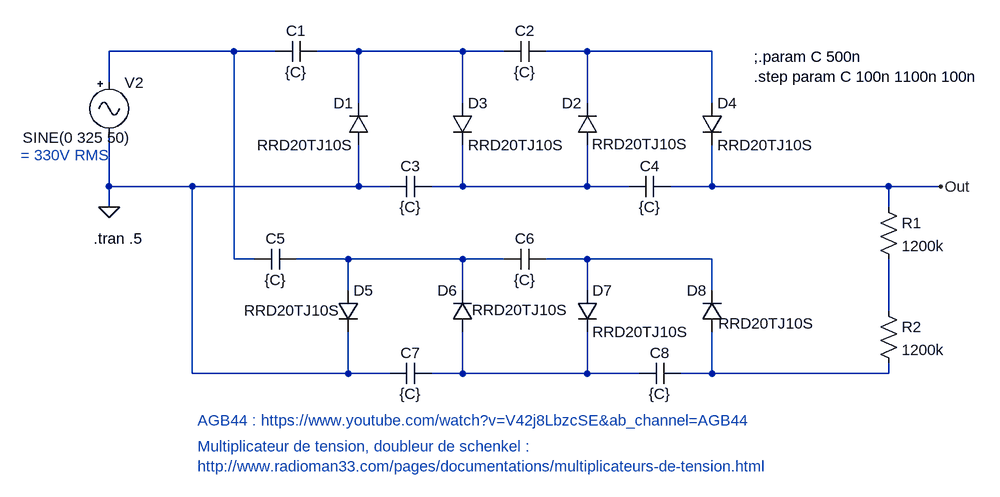
[diagram p0: schematic VoltMultiplier.asc]
VoltMultiplier.asc, the LTspice schematic file:
Version 4
SHEET 1 1520 960
WIRE 192 96 0 96
WIRE 256 96 192 96
WIRE 384 96 320 96
WIRE 544 96 384 96
WIRE 608 96 544 96
WIRE 736 96 672 96
WIRE 928 96 736 96
WIRE 0 144 0 96
WIRE 384 176 384 96
WIRE 544 176 544 96
WIRE 736 176 736 96
WIRE 928 176 928 96
WIRE 0 304 0 224
WIRE 128 304 0 304
WIRE 384 304 384 240
WIRE 384 304 128 304
WIRE 432 304 384 304
WIRE 544 304 544 240
WIRE 544 304 496 304
WIRE 736 304 736 240
WIRE 736 304 544 304
WIRE 800 304 736 304
WIRE 928 304 928 240
WIRE 928 304 864 304
WIRE 1200 304 928 304
WIRE 1280 304 1200 304
WIRE 0 336 0 304
WIRE 1200 336 1200 304
WIRE 192 416 192 96
WIRE 224 416 192 416
WIRE 368 416 288 416
WIRE 544 416 368 416
WIRE 608 416 544 416
WIRE 736 416 672 416
WIRE 928 416 736 416
WIRE 368 464 368 416
WIRE 544 464 544 416
WIRE 736 464 736 416
WIRE 928 464 928 416
WIRE 1200 496 1200 416
WIRE 128 592 128 304
WIRE 368 592 368 528
WIRE 368 592 128 592
WIRE 432 592 368 592
WIRE 544 592 544 528
WIRE 544 592 496 592
WIRE 736 592 736 528
WIRE 736 592 544 592
WIRE 816 592 736 592
WIRE 928 592 928 528
WIRE 928 592 880 592
WIRE 1200 592 1200 576
WIRE 1200 592 928 592
FLAG 1280 304 Out
FLAG 0 336 0
SYMBOL cap 320 80 R90
WINDOW 0 0 32 VBottom 2
WINDOW 3 32 32 VTop 2
SYMATTR InstName C1
SYMATTR Value {C}
SYMBOL cap 672 80 R90
WINDOW 0 0 32 VBottom 2
WINDOW 3 32 32 VTop 2
SYMATTR InstName C2
SYMATTR Value {C}
SYMBOL cap 496 288 R90
WINDOW 0 0 32 VBottom 2
WINDOW 3 32 32 VTop 2
SYMATTR InstName C3
SYMATTR Value {C}
SYMBOL cap 864 288 R90
WINDOW 0 0 32 VBottom 2
WINDOW 3 32 32 VTop 2
SYMATTR InstName C4
SYMATTR Value {C}
SYMBOL cap 288 400 R90
WINDOW 0 0 32 VBottom 2
WINDOW 3 32 32 VTop 2
SYMATTR InstName C5
SYMATTR Value {C}
SYMBOL cap 672 400 R90
WINDOW 0 0 32 VBottom 2
WINDOW 3 32 32 VTop 2
SYMATTR InstName C6
SYMATTR Value {C}
SYMBOL cap 496 576 R90
WINDOW 0 0 32 VBottom 2
WINDOW 3 32 32 VTop 2
SYMATTR InstName C7
SYMATTR Value {C}
SYMBOL cap 880 576 R90
WINDOW 0 0 32 VBottom 2
WINDOW 3 32 32 VTop 2
SYMATTR InstName C8
SYMATTR Value {C}
SYMBOL diode 400 240 R180
WINDOW 0 24 64 Left 2
WINDOW 3 24 0 Left 2
SYMATTR InstName D1
SYMATTR Value RRD20TJ10S
SYMBOL diode 752 240 R180
WINDOW 0 24 64 Left 2
WINDOW 3 -140 1 Left 2
SYMATTR InstName D2
SYMATTR Value RRD20TJ10S
SYMBOL diode 528 176 R0
SYMATTR InstName D3
SYMATTR Value RRD20TJ10S
SYMBOL diode 912 176 R0
SYMATTR InstName D4
SYMATTR Value RRD20TJ10S
SYMBOL diode 352 464 R0
WINDOW 3 -144 31 Left 2
SYMATTR InstName D5
SYMATTR Value RRD20TJ10S
SYMBOL diode 560 528 R180
WINDOW 0 24 64 Left 2
WINDOW 3 -147 34 Left 2
SYMATTR InstName D6
SYMATTR Value RRD20TJ10S
SYMBOL diode 720 464 R0
SYMATTR InstName D7
SYMATTR Value RRD20TJ10S
SYMBOL diode 944 528 R180
WINDOW 0 24 64 Left 2
WINDOW 3 -142 13 Left 2
SYMATTR InstName D8
SYMATTR Value RRD20TJ10S
SYMBOL res 1184 320 R0
SYMATTR InstName R1
SYMATTR Value 1200k
SYMBOL res 1184 480 R0
SYMATTR InstName R2
SYMATTR Value 1200k
SYMBOL Misc\\signal 0 128 R0
WINDOW 3 -133 101 Left 2
WINDOW 123 0 0 Left 0
WINDOW 39 0 0 Left 0
SYMATTR InstName V2
SYMATTR Value SINE(0 325 50)
TEXT -24 384 Left 2 !.tran .5
TEXT 136 704 Left 2 ;Multiplicateur de tension, doubleur de schenkel :\nhttp://www.radioman33.com/pages/documentations/multiplicateurs-de-tension.html
TEXT 136 664 Left 2 ;AGB44 : https://www.youtube.com/watch?v=V42j8LbzcSE&ab_channel=AGB44
TEXT 992 104 Left 2 !;.param C 500n\n.step param C 100n 1100n 100n
TEXT -136 256 Left 2 ;= 330V RMS

The netlist it stands for:
* VoltMultiplier.asc
C1 N002 N001 {C}
C2 N003 N002 {C}
C3 N004 0 {C}
C4 Out N004 {C}
C5 N005 N001 {C}
C6 N006 N005 {C}
C7 N008 0 {C}
C8 N009 N008 {C}
D1 0 N002 RRD20TJ10S
D2 N004 N003 RRD20TJ10S
D3 N002 N004 RRD20TJ10S
D4 N003 Out RRD20TJ10S
D5 N005 0 RRD20TJ10S
D6 N008 N005 RRD20TJ10S
D7 N006 N008 RRD20TJ10S
D8 N009 N006 RRD20TJ10S
R1 Out N007 1200k
R2 N007 N009 1200k
V2 N001 0 SINE(0 325 50)
.model D D
.lib standard.dio
.tran .5
* Multiplicateur de tension, doubleur de schenkel :
* http://www.radioman33.com/pages/documentations/multiplicateurs-de-tension.html
* AGB44 : https://www.youtube.com/watch?v=V42j8LbzcSE&ab_channel=AGB44
;.param C 500n
.step param C 100n 1100n 100n
* = 330V RMS
.backanno
.end